# Altium project DHT11-BaseBoard.PrjPcb
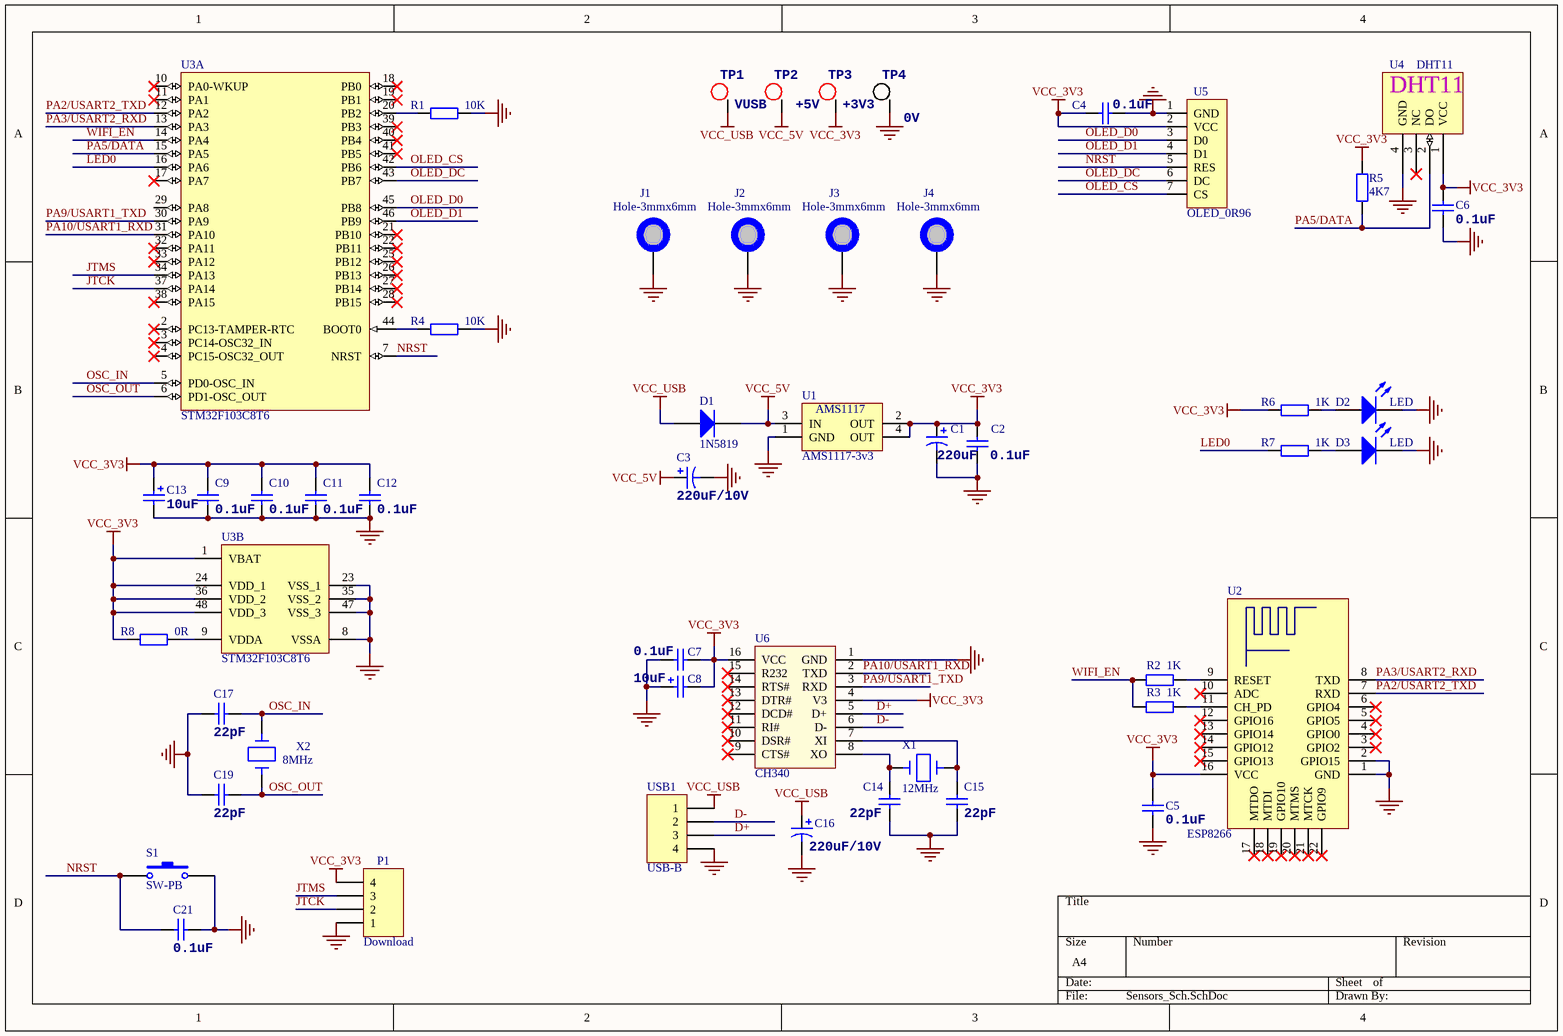
[diagram p0: Sensors_Sch.SchDoc]
1 sheet, 49 parts. Net scope: global (net labels, ports and power ports of the same name join across sheets).
Board file: dht11-pcb.PcbDoc

## Sheet Sensors_Sch.SchDoc
size A4

### Parts
C1  220uF  [C_SMD(6.3x5.3)]
C2  0.1uF  [C0603]
C3  220uF/10V  [C_SMD(6.3x5.3)]
C4  0.1uF  [C0603]
C5  0.1uF  [C0603]
C6  0.1uF  [C0603]
C7  0.1uF  [C0603]
C8  10uF  [TAC1206]
C9  0.1uF  [C0603]
C10  0.1uF  [C0603]
C11  0.1uF  [C0603]
C12  0.1uF  [C0603]
C13  10uF  [TAC1206]
C14  22pF  [C0603]
C15  22pF  [C0603]
C16  220uF/10V  [C_SMD(6.3x5.3)]
C17  22pF  [C0603]
C19  22pF  [C0603]
C21  0.1uF  [C0603]
D1  1N5819  [SOD123]
D2  LED  [LED_0603]
D3  LED  [LED_0603]
J1  Hole-3mmx6mm  [M3x7+6_L]
J2  Hole-3mmx6mm  [M3x7+6_L]
J3  Hole-3mmx6mm  [M3x7+6_L]
J4  Hole-3mmx6mm  [M3x7+6_L]
P1  Download  [HDR1X4]
R1  10K  [R0603]
R2  1K  [R0603]
R3  1K  [R0603]
R4  10K  [R0603]
R5  4K7  [R0603]
R6  1K  [R0603]
R7  1K  [R0603]
R8  0R  [R0603]
S1  SW-PB  [micro button_2_SMD]
TP1  VUSB  [TP]
TP2  +5V  [TP]
TP3  +3V3  [TP]
TP4  0V  [TP]
U1  AMS1117-3v3  [SOT223_L]
U2  ESP8266  [ESP8266]
U3  STM32F103C8T6  [LQFP48 7X7_N]  (parts A,B of 2)
U4  DHT11  [DHT11]
U5  OLED_0R96  [OLED_0.96_SPI]
U6  CH340  [SOIC_16]
USB1  USB-B  [USB-B]
X1  12MHz  [HC-49SMD]
X2  8MHz  [HC-49SMD]

### Nets
GND: C1.2(-) C2.1 C3.2(-) C4.1 C5.2 C6.2 C7.2 C8.1(+) C9.1 C10.1 C11.1 C12.1 C13.2(-) C14.1 C15.1 C16.2(-) C17.2 C19.2 C21.1 D2.2(K) D3.2(K) J1.0 J2.0 J3.0 J4.0 P1.1 R1.2 R4.2 S1.2 TP4.1 U1.1(GND) U2.1(GND) U2.2(GPIO15) U3.8(VSSA) U3.23(VSS_1) U3.35(VSS_2) U3.47(VSS_3) U4.4(GND) U5.1(GND) U6.1(GND) USB1.4
VCC_3V3: C1.1(+) C2.2 C4.2 C5.1 C6.1 C7.1 C8.2(-) C9.2 C10.2 C11.2 C12.2 C13.1(+) P1.4 R5.2 R6.1 R8.1 TP3.1 U1.2(OUT) U1.4(OUT) U2.16(VCC) U3.1(VBAT) U3.24(VDD_1) U3.36(VDD_2) U3.48(VDD_3) U4.1(VCC) U5.2(VCC) U6.4(V3) U6.16(VCC)
VCC_5V: C3.1(+) D1.2(K) TP2.1 U1.3(IN)
VCC_USB: C16.1(+) D1.1(A) TP1.1 USB1.1
D+: U6.5(D+) USB1.3
D-: U6.6(D-) USB1.2
JTCK: P1.2 U3.37(PA14)
JTMS: P1.3 U3.34(PA13)
LED0: R7.1 U3.16(PA6)
NRST: C21.2 S1.1 U3.7(NRST) U5.5(RES)
OLED_CS: U3.42(PB6) U5.7(CS)
OLED_D0: U3.45(PB8) U5.3(D0)
OLED_D1: U3.46(PB9) U5.4(D1)
OLED_DC: U3.43(PB7) U5.6(DC)
OSC_IN: C17.1 U3.5(PD0-OSC_IN) X2.2(X2)
OSC_OUT: C19.1 U3.6(PD1-OSC_OUT) X2.1(X1)
PA2/USART2_TXD: U2.7(RXD) U3.12(PA2)
PA3/USART2_RXD: U2.8(TXD) U3.13(PA3)
PA5/DATA: R5.1 U3.15(PA5) U4.2(DO)
PA9/USART1_TXD: U3.30(PA9) U6.3(RXD)
PA10/USART1_RXD: U3.31(PA10) U6.2(TXD)
WIFI_EN: R2.1 R3.1 U3.14(PA4)
NetC14_2: C14.2 U6.8(XO) X1.2(X2)
NetC15_2: C15.2 U6.7(XI) X1.1(X1)
NetD2_1: D2.1(A) R6.2
NetD3_1: D3.1(A) R7.2
NetR1_1: R1.1 U3.20(PB2)
NetR2_2: R2.2 U2.9(RESET)
NetR3_2: R3.2 U2.11(CH_PD)
NetR4_1: R4.1 U3.44(BOOT0)
NetR8_2: R8.2 U3.9(VDDA)

Not connected (* = marked no-connect by the designer): U2 3(GPIO2)* 4(GPIO0)* 5(GPIO5)* 6(GPIO4)* 10(ADC)* 12(GPIO16)* 13(GPIO14)* 14(GPIO12)* 15(GPIO13)* 17(MTDO)* 18(MTDI)* 19(GPIO10)* 20(MTMS)* 21(MTCK)* 22(GPIO9)*; U3 2(PC13-TAMPER-RTC)* 3(PC14-OSC32_IN)* 4(PC15-OSC32_OUT)* 10(PA0-WKUP)* 11(PA1)* 17(PA7)* 18(PB0)* 19(PB1)* 21(PB10)* 22(PB11)* 25(PB12)* 26(PB13)* 27(PB14)* 28(PB15)* 29(PA8) 32(PA11)* 33(PA12)* 38(PA15)* 39(PB3)* 40(PB4)* 41(PB5)*; U4 3(NC)*; U6 9(CTS#)* 10(DSR#)* 11(RI#)* 12(DCD#)* 13(DTR#)* 14(RTS#)* 15(R232)*

### Notes on the sheet
- (in symbol AMS1117-3v3) AMS1117

### Library data of the parts
C1 C3 C16 = Cap3: CAP ALUM POLY 150UF 20% 10V SMD; Manufacturer: KEMET; Manufacturer Part Number: A765EB157M1ALAE022; Type: Polymer; ESR (Equivalent Series Resistance): 22 mOhm; Lifetime @ Temp.: 2000 Hrs @ 105°C; Surface Mount Land Size: 0.260" L x 0.260" W (6.60mm x 6.60mm); Supplier 1: Digi-Key; RoHS: RoHS Compliant; Category: Capacitors; Stock 1: 2690; Pricing 1: 1=0.62, 10=0.44, 100=0.2899, 500=0.2147 (USD); Packaging: Cut Tape (CT); Part Status: Active; Tolerance: ±20%; Operating Temperature: -55°C ~ 105°C; Ratings: -; Applications: General Purpose; Lead Spacing: -; Size / Dimension: 0.248" Dia (6.30mm); Height - Seated (Max): 0.236" (6.00mm); Mounting Type: Surface Mount; Package / Case: Radial, Can - SMD; ComponentLink1URL: https://api.kemet.com/component-edge/download/datasheet/A765EB157M1ALAE022.pdf; ComponentLink1Description: https://api.kemet.com/component-edge/download/datasheet/A765EB157M1ALAE022.pdf; Supplier Part Number 1: 399-13671-1-ND
  C1: Value: 220uF
  C3 C16: Value: 220uF/10V
C2 C4-C7 C9-C12 C14 C15 C17 C19 C21 = Cap1: CAP CER 10000PF 100V X7R 0603; Manufacturer: TDK Corporation; Manufacturer Part Number: C1608X7R2A103K080AA; Tolerance: ±10%; Notification: Current market demand for these product types have resulted in fluctuating and extending lead times. Lead times may differ.; Supplier 1: Digi-Key; RoHS: RoHS Compliant; Category: Capacitors; Stock 1: 40000; Pricing 1: 4000=0.01438 (USD); Packaging: Tape & Reel (TR); Part Status: Active; Voltage - Rated: 100V; Temperature Coefficient: X7R; Operating Temperature: -55°C ~ 125°C; Features: -; Ratings: -; Applications: General Purpose; Failure Rate: -; Mounting Type: Surface Mount, MLCC; Package / Case: 0603 (1608 Metric); Size / Dimension: 0.063" L x 0.032" W (1.60mm x 0.80mm); Height - Seated (Max): -; Thickness (Max): 0.035" (0.90mm); Lead Spacing: -; Lead Style: -; ComponentLink1URL: https://product.tdk.com/info/en/catalog/datasheets/mlcc_commercial_midvoltage_en.pdf; ComponentLink1Description: https://product.tdk.com/info/en/catalog/datasheets/mlcc_commercial_midvoltage_en.pdf; Supplier Part Number 1: 445-1304-2-ND
  C2 C4-C7 C9-C12 C21: Value: 0.1uF
  C14 C15 C17 C19: Value: 22pF
C8 = Cap2: CAP TANT 10UF 10V 10% 1206; pin to pad: 1>2 2>1; Manufacturer: KEMET; Manufacturer Part Number: T491A106K010AT7280; Manufacturer Size Code: A; Type: Molded; ESR (Equivalent Series Resistance): 3.8 Ohm; Lifetime @ Temp.: 2000 Hrs @ 125°C; Notification: Current market demand for these product types have resulted in fluctuating and extending lead times. Lead times may differ.; Supplier 1: Digi-Key; RoHS: RoHS Compliant; Category: Capacitors; Stock 1: 27000; Pricing 1: 9000=0.084, 18000=0.08138, 27000=0.07875, 63000=0.0735 (USD); Packaging: Tape & Reel (TR); Part Status: Active; Tolerance: ±10%; Operating Temperature: -55°C ~ 125°C; Mounting Type: Surface Mount; Package / Case: 1206 (3216 Metric); Size / Dimension: 0.126" L x 0.063" W (3.20mm x 1.60mm); Height - Seated (Max): 0.071" (1.80mm); Lead Spacing: -; Features: General Purpose; Failure Rate: -; ComponentLink1URL: https://api.kemet.com/component-edge/download/datasheet/T491A106K010AT7280.pdf; ComponentLink1Description: https://api.kemet.com/component-edge/download/datasheet/T491A106K010AT7280.pdf; Supplier Part Number 1: 399-8268-2-ND; Value: 10uF
C13 = Cap2: CAP TANT 10UF 10V 10% 1206; Manufacturer: KEMET; Manufacturer Part Number: T491A106K010AT7280; Manufacturer Size Code: A; Type: Molded; ESR (Equivalent Series Resistance): 3.8 Ohm; Lifetime @ Temp.: 2000 Hrs @ 125°C; Notification: Current market demand for these product types have resulted in fluctuating and extending lead times. Lead times may differ.; Supplier 1: Digi-Key; RoHS: RoHS Compliant; Category: Capacitors; Stock 1: 27000; Pricing 1: 9000=0.084, 18000=0.08138, 27000=0.07875, 63000=0.0735 (USD); Packaging: Tape & Reel (TR); Part Status: Active; Tolerance: ±10%; Operating Temperature: -55°C ~ 125°C; Mounting Type: Surface Mount; Package / Case: 1206 (3216 Metric); Size / Dimension: 0.126" L x 0.063" W (3.20mm x 1.60mm); Height - Seated (Max): 0.071" (1.80mm); Lead Spacing: -; Features: General Purpose; Failure Rate: -; ComponentLink1URL: https://api.kemet.com/component-edge/download/datasheet/T491A106K010AT7280.pdf; ComponentLink1Description: https://api.kemet.com/component-edge/download/datasheet/T491A106K010AT7280.pdf; Supplier Part Number 1: 399-8268-2-ND; Value: 10uF
D1 = Diode: Default Diode; Published: 8-Jun-2000; LatestRevisionDate: 17-Jul-2002; LatestRevisionNote: Re-released for DXP Platform.; PackageVersion: Sep-1996; PackageReference: SMC; Publisher: Altium Limited; PackageDescription: DO-214-AB/SMC; 2 C-Bend Leads; Body 7.9 x 5.9 mm, inc. leads (LxW); Code_JEDEC: DO-214-AB
D2 D3 = LED: Typical RED GaAs LED; Published: 8-Jun-2000; LatestRevisionDate: 08-Jul-2005; LatestRevisionNote: Mech Layer 1 removed.; PackageReference: LED-1; Publisher: Altium Limited; PackageDescription: LED; 2 Leads
J1-J4 = HOLED: pin to pad: 0>1
P1 USB1 = Header 4: Header, 4-Pin; LatestRevisionDate: 17-Jul-2002; LatestRevisionNote: Re-released for DXP Platform.; Publisher: Altium Limited
R1-R8 = R: 贴片电阻; 版权归属: 源创客; BOM名称: 贴片电阻; 学习资源: www.ooocke.com
  R1 R4: Value: 10K
  R2 R3 R6 R7: Value: 1K
  R5: Value: 4K7
  R8: Value: 0R
S1 = SW-PB: Switch; Published: 24-Mar-1999; LatestRevisionDate: 17-Jul-2002; LatestRevisionNote: Re-released for DXP Platform.; PackageReference: SPST-2; Publisher: Altium Limited; PackageDescription: Switch; 2 Leads
TP1-TP3 = TP+: 正测试环
TP4 = TP-: 负测试环
U2 = ESP8266 Module
U3 = STM32F103C8T6: ARM Cortex-M3 32-bit MCU, 64 KB Flash, 20 KB Internal RAM, 37 I/Os, 48-pin LQFP, -40 to 85 degC, Tray; A/D Converter: 2x12-bit (10 Channel); FLASH Size (Prog) (kB): 64; I/Os (High Current): 37; Internal RAM Size (kB): 20; Operating Frequency(F) (Processor speed) (MHz): 72; Supply Voltage(Vcc) min (V): 2; DatasheetVersion: Rev. 16; PackageVersion: Rev. 6, 06/2013; PackageReference: LQFP48; PackageDescription: 48-Pin Low Profile Quad Flat Package, 7 x 7 mm Body, 0.5 mm Pitch; Supplier 1: Digi-Key; Supplier Part Number 1: 497-6063-ND; Supplier 2: Farnell; Supplier Part Number 2: 1447637; Supplier 3: Newark; Supplier Part Number 3: 59M2182; Supplier 4: Newark; Supplier Part Number 4: 57P1222; Supplier 5: Mouser; Supplier Part Number 5: 511-STM32F103C8T6; Core: ARM Cortex-M3; Packing: Tray; Mounting Technology: Surface Mount; PartNumber: STM32F103C8T6; ComponentLink1Description: Manufacturer URL; ComponentLink1URL: http://www.st.com/web/en/home.html; ComponentLink2Description: Datasheet; ComponentLink2URL: http://www.st.com/st-web-ui/static/active/en/resource/technical/document/datasheet/CD00161566.pdf; ComponentLink3Description: Package Specification; ComponentLink3URL: http://www.st.com/st-web-ui/static/active/en/resource/technical/document/datasheet/DM00058181.pdf
U4 = DHT11: GROVE TEMP/HUMIDITY SENSOR; Manufacturer: Seeed Technology Co., Ltd; Manufacturer Part Number: 101020011; Function: Humidity, Temperature; Contents: Board(s), Cable(s); Supplier 1: Digi-Key; RoHS: RoHS Compliant; Category: Development Boards, Kits, Programmers; Stock 1: 94; Pricing 1: 1=6.02 (USD); Part Status: Active; Platform: Grove; Type: Sensor; Utilized IC / Part: DHT11; ComponentLink1URL: http://www.seeedstudio.com/wiki/Grove-_Temperature_and_Humidity_Sensor; ComponentLink1Description: http://www.seeedstudio.com/wiki/Grove-_Temperature_and_Humidity_Sensor; Supplier Part Number 1: 1597-1124-ND
U5 = OLED_7P_0R96
X1 X2 = Crystal: CRYSTAL 12.0000MHZ 18PF SMD; Manufacturer: Abracon LLC; Manufacturer Part Number: ABLS-12.000MHZ-B2-T; Frequency Stability: ±50ppm; Frequency Tolerance: ±20ppm; Operating Mode: Fundamental; Supplier 1: Digi-Key; RoHS: RoHS Compliant; Category: Crystals, Oscillators, Resonators; Stock 1: 85000; Pricing 1: 1000=0.136, 3000=0.1275, 5000=0.12325, 10000=0.119 (USD); Packaging: Tape & Reel (TR); Part Status: Active; Type: MHz Crystal; Load Capacitance: 18pF; Operating Temperature: -20°C ~ 70°C; Ratings: -; Mounting Type: Surface Mount; Package / Case: HC-49/US; Size / Dimension: 0.449" L x 0.185" W (11.40mm x 4.70mm); Height - Seated (Max): 0.165" (4.20mm); ComponentLink1URL: https://abracon.com/Resonators/abls.pdf; ComponentLink1Description: https://abracon.com/Resonators/abls.pdf; Supplier Part Number 1: 535-9067-2-ND
  X1: Value: 12MHz
  X2: Value: 8MHz